# EAGLE design vswr (EAGLE 7.3.0)
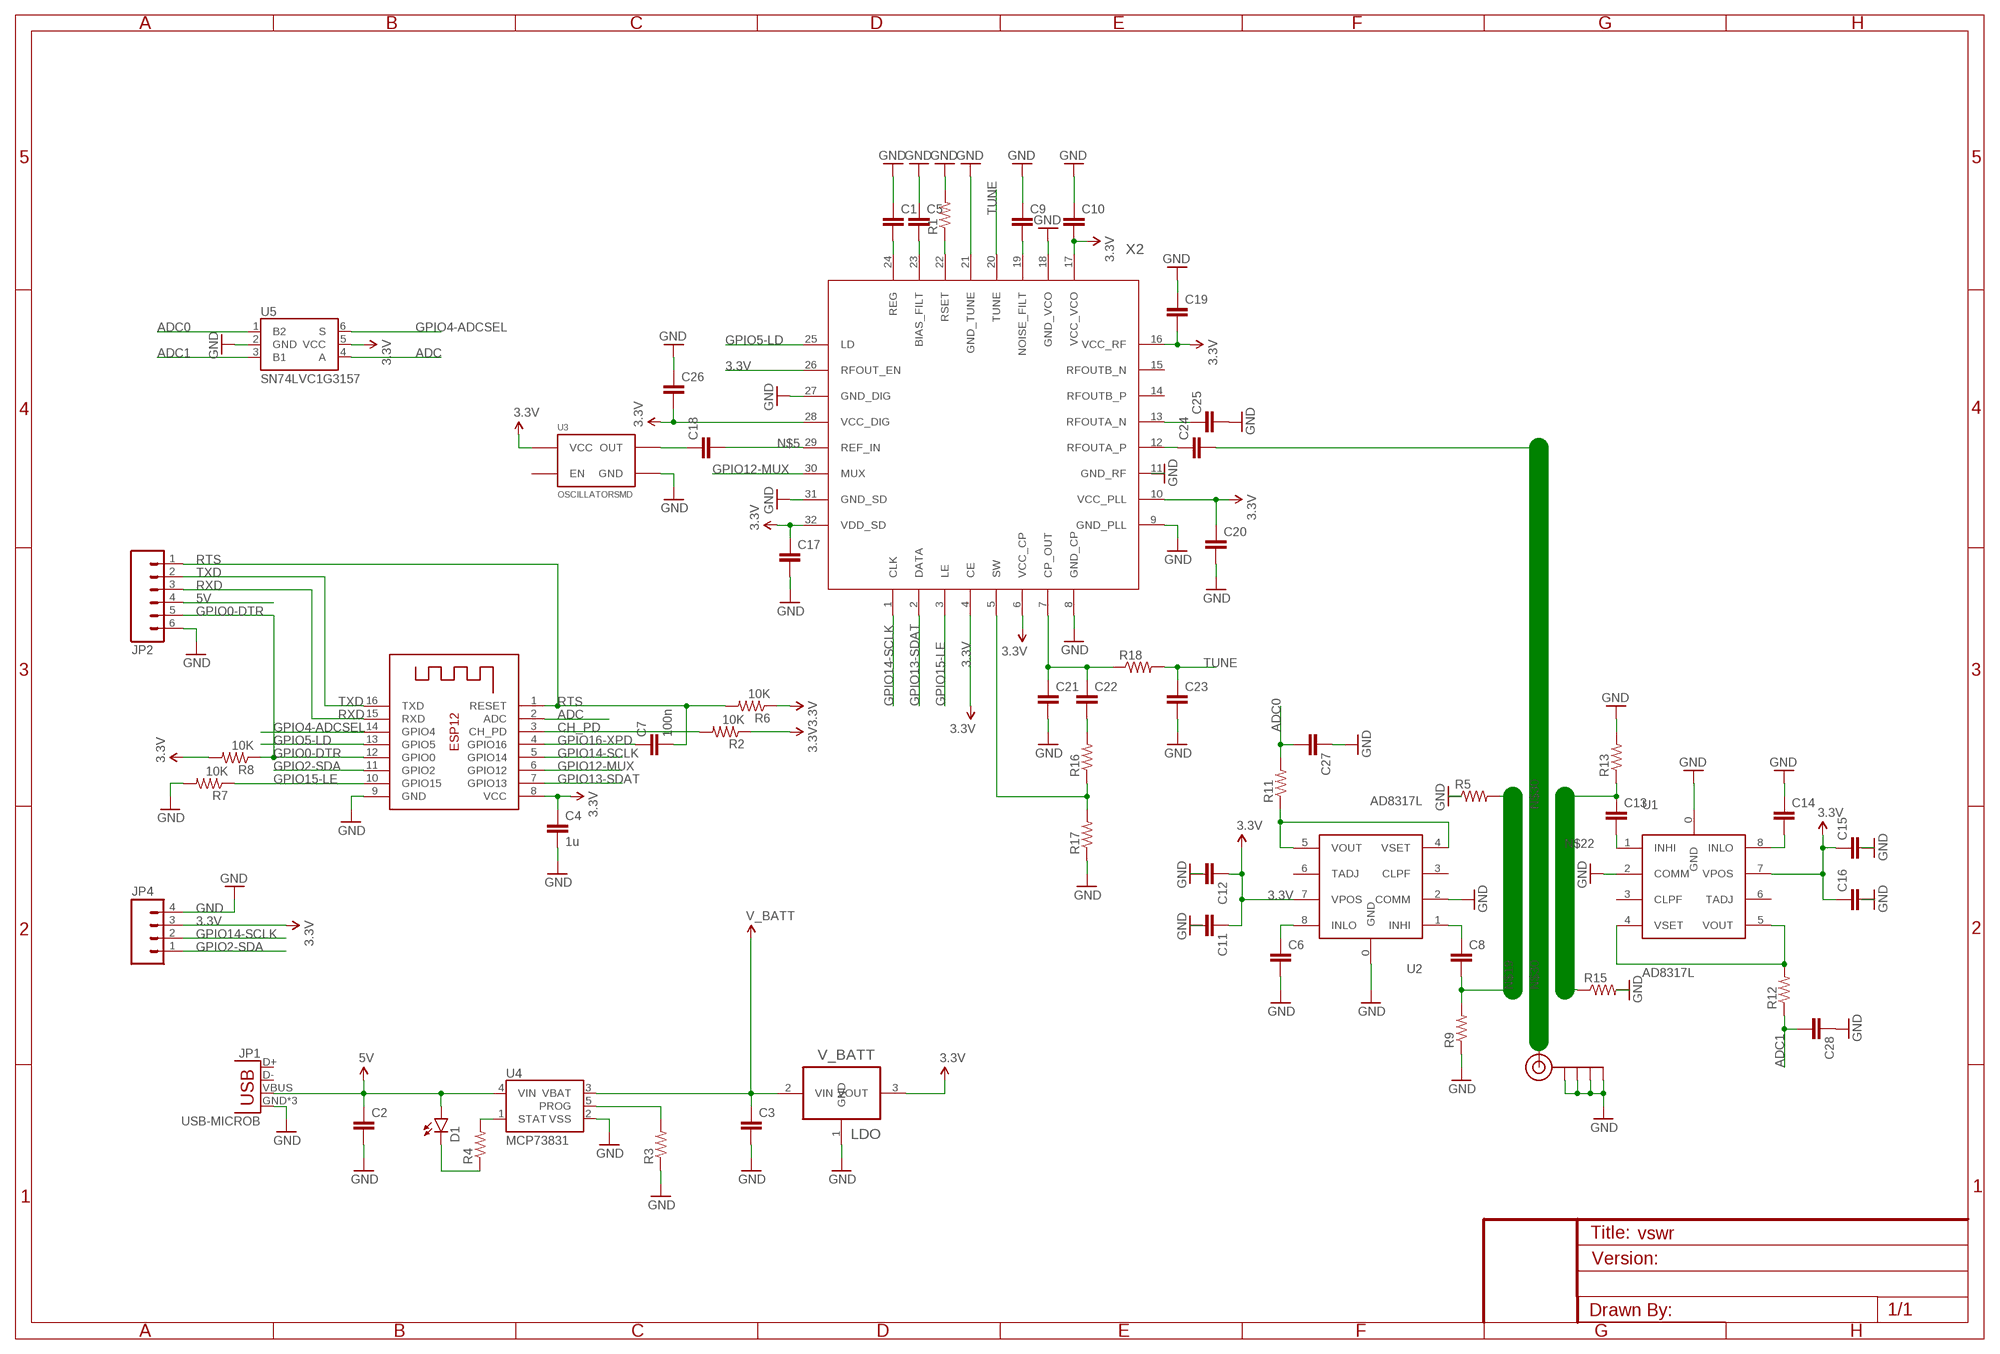
[diagram p0: schematic, sheet 1]

## Parts
C1  CAP0402  [0402]
C2  CAP0603  [0603]
C3  CAP0603  [0603]
C4  1u  CAP0603  [0603]
C5  CAP0402  [0402]
C6  CAP0402  [0402]
C7  100n  CAP0603  [0603]
C8  CAP0402  [0402]
C9  CAP0402  [0402]
C10  CAP0402  [0402]
C11  CAP0402  [0402]
C12  CAP0603  [0603]
C13  CAP0402  [0402]
C14  CAP0402  [0402]
C15  CAP0402  [0402]
C16  CAP0603  [0603]
C17  CAP0402  [0402]
C18  CAP0402  [0402]
C19  CAP0402  [0402]
C20  CAP0402  [0402]
C21  CAP0603  [0603]
C22  CAP0603  [0603]
C23  CAP0603  [0603]
C24  CAP0402  [0402]
C25  CAP0402  [0402]
C26  CAP0402  [0402]
C27  CAP0603  [0603]
C28  CAP0603  [0603]
D1  LED0603  [LED-0603]
J$1  SMA_EDGE  [SMA-EDGE]
JP1  USB-MICROB  [USB-MICROB]
JP2  M061X06-SMD_EDGE_FEMALE  [1X06-SMD_EDGE]
JP4  M04PTH  [1X04]
R1  RESISTOR0402  [0402]
R2  10K  RESISTOR0603  [0603]
R3  RESISTOR0603  [0603]
R4  RESISTOR0603  [0603]
R5  RESISTOR0402  [0402]
R6  10K  RESISTOR0603  [0603]
R7  10K  RESISTOR0603  [0603]
R8  10K  RESISTOR0603  [0603]
R9  RESISTOR0402  [0402]
R11  RESISTOR0603  [0603]
R12  RESISTOR0603  [0603]
R13  RESISTOR0402  [0402]
R15  RESISTOR0402  [0402]
R16  RESISTOR0402  [0402]
R17  RESISTOR0402  [0402]
R18  RESISTOR0402  [0402]
U1  AD8317L  [DFN-8-EXTRA]
U2  AD8317L  [DFN-8-EXTRA]
U3  OSCILLATORSMD  [CRYSTAL-SMD-7X5]
U4  MCP73831  [SOT23-5]
U5  SN74LVC1G3157  [SOT23-6]
V_BATT  LDO  MCP1700T-3302E/TTSOT89MCP1700-3N  [SOT89R]
X1  ESP-12  [ESP-12]
X2  MAX2870TQFN-32-EXTRA  [TQFN-32-EXTRA]

## Nets
3.3V: C4.1 C10.2 C11.1 C12.1 C15.1 C16.1 C17.1 C19.2 C20.1 C26.2 JP4.3 R2.1 R6.1 R8.2 U1.7(VPOS) U2.7(VPOS) U3.P$4(VCC) U5.5(VCC) V_BATT.3(VOUT) X1.8(VCC) X2.4(CE) X2.6(VCC_CP) X2.10(VCC_PLL) X2.16(VCC_RF) X2.17(VCC_VCO) X2.26(RFOUT_EN) X2.28(VCC_DIG) X2.32(VDD_SD)
5V: C2.1 D1.A JP1.VBUS JP2.4 U4.4(VIN)
ADC: U5.4(A) X1.2(ADC)
ADC0: C27.2 R11.2 U5.1(B2)
ADC1: C28.2 R12.1 U5.3(B1)
CH_PD: R2.2 X1.3(CH_PD)
GND [POWER]: C1.1 C2.2 C3.2 C4.2 C5.1 C6.2 C9.1 C10.1 C11.2 C12.2 C14.1 C15.2 C16.2 C17.2 C19.1 C20.2 C21.2 C23.2 C25.2 C26.1 C27.1 C28.1 J$1.GND@0(GND) J$1.GND@1(GND) J$1.GND@2(GND) J$1.GND@3(GND) JP1.GND JP1.MT1(GND) JP1.MT2(GND) JP2.6 JP4.4 R1.2 R3.1 R5.1 R7.2 R9.1 R13.2 R15.2 R17.1 U1.0(GND) U1.2(COMM) U2.0(GND) U2.2(COMM) U3.P$2(GND) U4.2(VSS) U5.2(GND) V_BATT.1(GND) X1.9(GND) X2.8(GND_CP) X2.9(GND_PLL) X2.11(GND_RF) X2.18(GND_VCO) X2.21(GND_TUNE) X2.27(GND_DIG) X2.31(GND_SD)
GPIO0-DTR: JP2.5 R8.1 X1.12(GPIO0)
GPIO2-SDA: JP4.1 X1.11(GPIO2)
GPIO4-ADCSEL: U5.6(S) X1.14(GPIO4)
GPIO5-LD: X1.13(GPIO5) X2.25(LD)
GPIO12-MUX: X1.6(GPIO12) X2.30(MUX)
GPIO13-SDAT: X1.7(GPIO13) X2.2(DATA)
GPIO14-SCLK: JP4.2 X1.5(GPIO14) X2.1(CLK)
GPIO15-LE: R7.1 X1.10(GPIO15) X2.3(LE)
GPIO16-XPD: C7.1 X1.4(GPIO16)
N$1: C1.2 X2.24(REG)
N$2: C5.2 X2.23(BIAS_FILT)
N$4: C9.2 X2.19(NOISE_FILT)
N$5: C18.2 X2.29(REF_IN)
N$8: D1.C R4.1
N$10: C13.2 U1.1(INHI)
N$11: R1.1 X2.22(RSET)
N$15: C6.1 U2.8(INLO)
N$16: C25.1 X2.13(RFOUTA_N)
N$18: C8.1 U2.1(INHI)
N$19: C8.2 R5.2 R9.2
N$20: R11.1 U2.4(VSET) U2.5(VOUT)
N$21: C18.1 U3.P$3(OUT)
N$22: C13.1 R13.1 R15.1
N$23: C21.1 C22.1 R18.1 X2.7(CP_OUT)
N$24: C24.1 X2.12(RFOUTA_P)
N$25: C14.2 U1.8(INLO)
N$26: C22.2 R16.2
N$27: R12.2 U1.4(VSET) U1.5(VOUT)
N$28: R16.1 R17.2 X2.5(SW)
N$30: C24.2 J$1.SIG(SIGNAL)
PROG: R3.2 U4.5(PROG)
RTS: C7.2 JP2.1 R6.2 X1.1(RESET)
RXD: JP2.3 X1.15(RXD)
STAT: R4.2 U4.1(STAT)
TUNE: C23.1 R18.2 X2.20(TUNE)
TXD: JP2.2 X1.16(TXD)
V_BATT [POWER]: C3.1 U4.3(VBAT) V_BATT.2(VIN)
Unconnected: JP1.D+ JP1.D- U1.3(CLPF) U1.6(TADJ) U2.3(CLPF) U2.6(TADJ) U3.P$1(EN) X2.14(RFOUTB_P) X2.15(RFOUTB_N)

## Library data of the parts
C1-C3 C5 C6 C8-C28 = drom:CAP: Capacitor
C4 C7 = naut:CAP: Capacitor
D1 = drom:LED: LEDs Standard schematic elements and footprints for 5mm, 3mm, 1206, and 0603 sized LEDs. 5mm - Spark Fun Electronics SKU : COM-00529 (and others)
J$1 = drom:SMA_EDGE: SMA Antenna Connector End launch SMA connector. The paste layer has been removed so that the connector can be hand soldered onto the board after reflow.
JP1 = drom:USB: USB Connectors; PROD_ID: CONN-09505
JP2 = drom:M06: Header 6 Standard 6-pin 0.1" header.
JP4 = drom:M04: Header 4 Standard 4-pin 0.1" header. Use with straight break away headers (SKU : PRT-00116), right angle break away headers (PRT-00553), swiss pins (PRT-00743), machine pins (PRT-00117), and female headers (PRT-00115). Molex polarized connector foot print use with SKU : PRT-08231 with associated crimp pins and housings. 1MM SMD Version SKU: PRT-10208
R1 R2 R5-R9 R11-R13 R15-R18 = drom:RESISTOR: Resistor
R3 R4 = naut:RESISTOR: Resistor
U1 U2 = drom:AD8317: Log Detector/Controller
U3 = drom:OSCILLATOR: Generic 7x5 oscillator
U4 = SparkFun-PowerIC:MCP73831: Miniature single cell, fully integrated Li-Ion, Li-polymer charge management controller http://ww1.microchip.com/downloads/en/DeviceDoc/21984a.pdf
U5 = drom:SN74LVC1G3157: Miniature single cell, fully integrated Li-Ion, Li-polymer charge management controller http://ww1.microchip.com/downloads/en/DeviceDoc/21984a.pdf
V_BATT = naut:MCP1700T-3302E/TT: Low Quiescent Current LDO
X1 = drom:ESP-12
X2 = drom:MAX2870

## Net classes
0 default: width 0.152 mm, drill 0.33 mm, clearance 0.152 mm
1 POWER: width 0.152 mm, drill 0.33 mm, clearance 0.152 mm

## Board
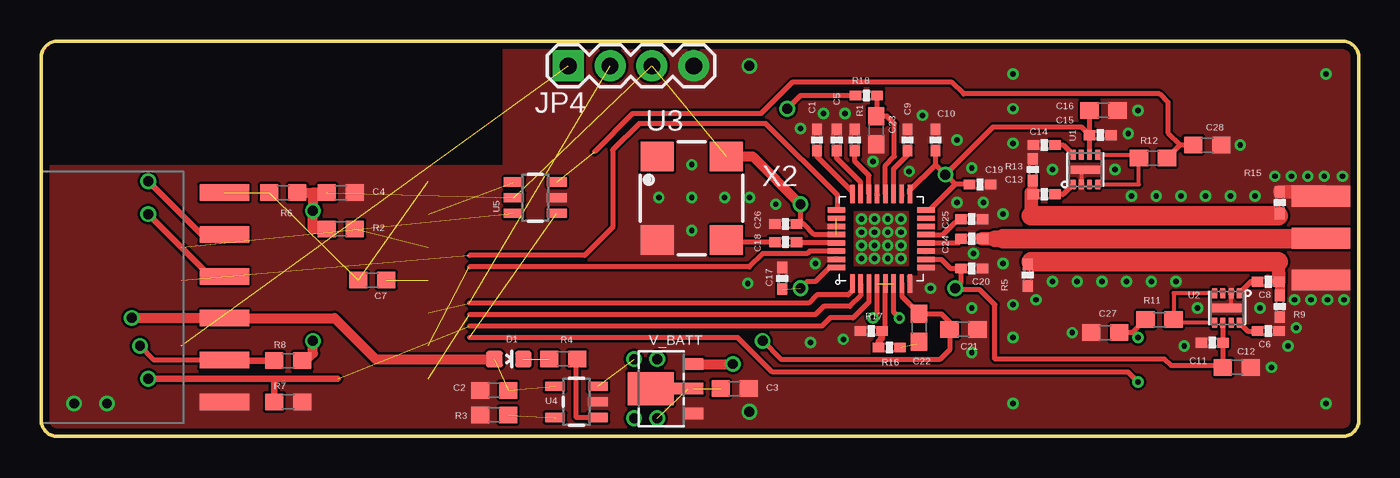
[diagram p1: board, top side]
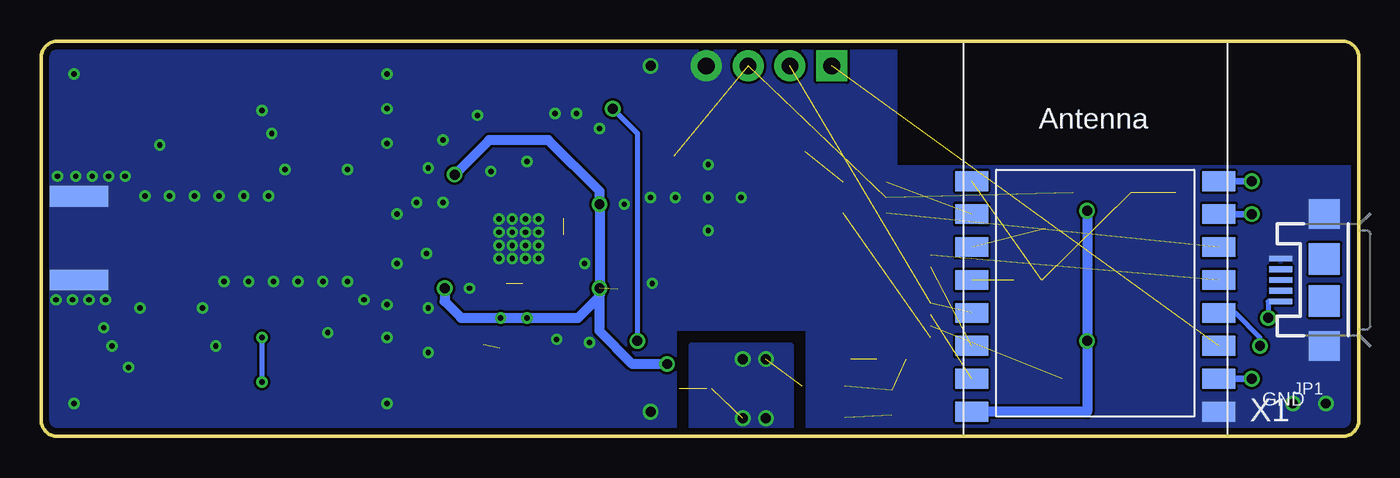
[diagram p2: board, bottom side, seen from below]

Size 80 x 24 mm. Coordinates in mm from the lower left corner, seen from the top.
Outline: 1,0 79,0 arc90 80,1 80,23 arc90 79,24 1,24 arc90 0,23 0,1 arc90 1,0
Copper layers (1*16): Top 0.0356mm / dielectric 0.52mm / Bottom 0.0356mm
Design rules "LaenPCBOrder *": minimum track width 6mil, minimum drill 13mil, track to track 6mil, track to pad 6mil, pad to pad 6mil, via to via 6mil, smd to smd 6mil, copper to edge 15mil, drill to drill 6mil, minimum pad ring 7mil, minimum via ring 7mil, stop-mask expansion 3mil, vias tented up to drill 24mil, thermal gap 0mil
tRestrict: area 48.8,13.7 to 53.2,14.2; area 48.8,9.8 to 49.3,14.2; area 48.8,9.8 to 53.2,10.3; area 52.7,9.8 to 53.2,14.2; area 0,16.5 to 28,24
bRestrict: area 0,16.5 to 28,24

### Footprints (pad centres in the part's own frame; a part is rotated, then mirrored left to right if it is on the bottom)
0402 = smd 0.7 x 0.6: 1 -0.65,0; 2 0.65,0
0603 = smd 1.1 x 1: 1 -0.85,0; 2 0.85,0
LED-0603 = smd 1 x 1: A 0,-0.877; C 0,0.877
SMA-EDGE = smd 1.27 x 3.556: GND@0 0,0; GND@1 5.08,0; SIG 2.54,0 | smd 1.27 x 3.556 bottom: GND@2 0,0; GND@3 5.08,0
USB-MICROB = smd 0.35 x 1.4: D+ 0,2.65; D- -0.65,2.65; GND 1.3,2.65; ID 0.65,2.65; VBUS -1.3,2.65 | smd 1.8 x 1.9: MT1 -4,0; MT2 4,0 | smd 1.9 x 1.9: P$1 -1.27,0; P$2 1.27,0
1X06-SMD_EDGE = smd 1 x 3: 1 0,-0.08; 2 2.54,-0.08; 3 5.08,-0.08; 4 7.62,-0.08; 5 10.16,-0.08; 6 12.7,-0.08
1X04 = drill 1.016 pad 1.88 square: 1 0,0 | drill 1.016 pad 1.88: 2 2.54,0; 3 5.08,0; 4 7.62,0
DFN-8-EXTRA = smd 0.5 x 1.8: 0 0,0 | smd 0.6 x 0.3: 1 -0.9,0.75; 2 -0.9,0.25; 3 -0.9,-0.25; 4 -0.9,-0.75; 5 0.9,-0.75; 6 0.9,0.25; 7 0.9,-0.25; 8 0.9,0.75
CRYSTAL-SMD-7X5 = smd 1.8 x 2: P$1 0,0; P$2 5.08,0; P$3 5.08,4.2; P$4 0,4.2
SOT23-5 = smd 0.55 x 1.2: 1 -0.95,-1.3; 2 0,-1.3; 3 0.95,-1.3; 4 0.95,1.3; 5 -0.95,1.3
SOT23-6 = smd 0.55 x 1.2: 1 -0.95,-1.3; 2 0,-1.3; 3 0.95,-1.3; 4 0.95,1.3; 5 0,1.3; 6 -0.95,1.3
SOT89R = smd 0.7 x 1.1: 1 -1.5,-1.75; 3 1.5,-1.75 | smd 0.7 x 1.8: 2 0,-1.4 | smd 2 x 2.8: 4 0,0.9
ESP-12 = smd 2 x 1.2: 1 -7.5,4.5; 2 -7.5,2.5; 3 -7.5,0.5; 4 -7.5,-1.5; 5 -7.5,-3.5; 6 -7.5,-5.5; 7 -7.5,-7.5; 8 -7.5,-9.5; 9 7.5,-9.5; 10 7.5,-7.5; 11 7.5,-5.5; 12 7.5,-3.5; 13 7.5,-1.5; 14 7.5,0.5; 15 7.5,2.5; 16 7.5,4.5
TQFN-32-EXTRA = smd 1.1 x 0.3: 1 -2.715,1.75; 2 -2.715,1.25; 3 -2.715,0.75; 4 -2.715,0.25; 5 -2.715,-0.25; 6 -2.715,-0.75; 7 -2.715,-1.25; 8 -2.715,-1.75; 17 2.715,-1.75; 18 2.715,-1.25; 19 2.715,-0.75; 20 2.715,-0.25; 21 2.715,0.25; 22 2.715,0.75; 23 2.715,1.25; 24 2.715,1.75 | smd 0.3 x 1.1: 9 -1.75,-2.715; 10 -1.25,-2.715; 11 -0.75,-2.715; 12 -0.25,-2.715; 13 0.25,-2.715; 14 0.75,-2.715; 15 1.25,-2.715; 16 1.75,-2.715; 25 1.75,2.715; 26 1.25,2.715; 27 0.75,2.715; 28 0.25,2.715; 29 -0.25,2.715; 30 -0.75,2.715; 31 -1.25,2.715; 32 -1.75,2.715

### Placement (x,y rotation side)
C1  47.1,18 270 top
C2  27.5,2.8 180 top
C3  42.1,2.9 0 top
C4  18.2,14.8 0 top
C5  48.3,18 270 top
C6  74.5,6.4 0 top
C7  20.1,9.5 180 top
C8  74.5,9.4 0 top
C9  52.6,18 270 top
C10  54.3,18 270 top
C11  71.1,5.7 180 top
C12  72.6,4.2 0 top
C13  60.9,14.7 0 top
C14  60.9,17.7 0 top
C15  64.3,18.3 0 top
C16  64.5,19.8 0 top
C17  45,9.6 90 top
C18  45.2,11.8 0 top
C19  57,15.3 180 top
C20  56.5,10.2 0 top
C21  56,6.5 0 top
C22  53.3,6.6 270 top
C23  50.7,18.6 270 top
C24  56.5,12 0 top
C25  56.5,13.2 0 top
C26  45.2,12.9 0 top
C27  64.6,6.3 0 top
C28  70.8,17.7 180 top
D1  28.4,4.7 270 top
J$1  77.7,9.5 90 top
JP1  2.1,9.5 90 bottom
JP2  11.2,14.8 270 top
JP4  32,22.5 0 top
R1  49.4,18 90 top
R2  18.2,12.6 0 top
R3  27.5,1.3 0 top
R4  31.7,4.7 0 top
R5  59.9,9.8 90 top
R6  14.7,14.8 180 top
R7  15,2.1 0 top
R8  15,4.6 0 top
R9  75.2,7.9 90 top
R11  67.9,7.1 180 top
R12  67.5,16.9 180 top
R13  60.2,16.2 90 top
R15  75.2,14.2 90 top
R16  51.5,5.4 0 top
R17  50.4,6.4 0 top
R18  50.1,20.7 0 top
U1  63.4,16.2 90 top
U2  72,7.8 270 top
U3  37.4,17 270 top
U4  32.5,2.1 90 top
U5  30,14.5 90 top
V_BATT  37.9,2.9 90 top
X1  16,11 0 bottom
X2  51,12 90 top

### Tracks (layer width: path | path; a pad name or v marks a point on that pad's centre or on a via)
3.3V  (via drill 0.33, 0.6)  (6 unrouted)
  Top 0.305: C12.1 C11.1 U2.7 71.75,4.3 68.6,4.3 68.2,4.7 57.9,4.7 57.9,8 57,8.9 55.6,8.9 v55.5,9 55.85,9.35 C20.1 55.2,10.2 54.65,10.75 X2.10 | U1.7 C15.1 | C15.1 C16.1 | v54.9,15.9 57.8,18.8 63.15,18.8 C15.1 | 52.75,15.05 X2.17 52.75,14.95 54.3,16.5 | 54.3,16.5 C10.2 | X2.16 53.95,13.75 55.5,15.3 | v54.9,15.9 54.3,16.5 | C19.2 55.5,15.3 | 55.5,15.3 v54.9,15.9 | X2.28 46.95,12.25 46.3,12.9 C26.2 46.1,13.1 v46.1,14.1 | v50.5,7.2 50.75,7.45 X2.4 | v52.1,7.2 51.75,7.55 X2.6 | X2.32 47.85,10.25 47,9.4 46.5,9.4 v46.1,9
  Top 0.406: 15.95,4.5 R8.2
  Top 0.61: U3.P$4 43.2,17 v46.1,14.1 | V_BATT.3 v42,4.4 | 15.95,4.5 16.5,5.05 v16.5,5.8 | R6.1 16.5,14.8 | C4.1 16.5,14.8 | 16.5,14.8 v16.5,13.7 16.5,12.6 R2.1
  Bottom 0.61: v46.1,9 46.1,8.5 47.4,7.2 v52.1,7.2 54.5,7.2 55.5,8.2 v55.5,9 | v46.1,9 v46.1,14.1 46.1,14.9 49.2,18 52.8,18 v54.9,15.9 | v42,4.4 44.1,4.4 46.1,6.4 v46.1,9 | v16.5,13.7 v16.5,5.8 16.5,1.5 X1.8
5V  (via drill 0.6)  (2 unrouted)
  Top 0.61: D1.A 20.3,4.7 17.82,7.18 JP2.4 5.52,7.18 v5.5,7.2
  Bottom 0.305: JP1.VBUS 5.5,8.2 v5.5,7.2
ADC  (1 unrouted)
ADC0  (via drill 0.33)  (1 unrouted)
  Top 0.305: v66.6,3.3 66,3.9 44.4,3.9 42.3,6 26,6 | R11.2 66.25,6.3 C27.2 66.3,6.3 v66.6,6
  Bottom 0.305: v66.6,6 v66.6,3.3
ADC1  (1 unrouted)
  Top 0.305: R12.1 69.15,17.7 | 69.15,17.7 C28.2 | 69.15,17.7 68.4,18.45 68.4,20.3 67.9,20.8 56,20.8 55.3,21.5 45.6,21.5 43.7,19.6 35.9,19.6 33.6,17.3
CH_PD  (1 unrouted)
GND  (via drill 0.33, 0.6)
  Top 0.254: U1.0 63.15,16.2 U1.2 | U2.0 72.25,7.8 U2.2
  Top 0.406: 77.9,14.85 J$1.GND@3
  Top 0.813: R15.2 77.9,14.85
  other vias: 49.8,13.2 50.6,13.2 51.4,13.2 52.2,13.2 49.8,12.4 50.6,12.4 51.4,12.4 52.2,12.4 52.2,11.6 51.4,11.6 50.6,11.6 49.8,11.6 49.8,10.8 50.6,10.8 51.4,10.8 52.2,10.8 70.2,7.8 74,7.8 65.9,9.4 64.4,9.4 62.9,9.4 59,8 61.4,9.4 68.9,9.4 67.4,9.4 73.7,14.6 72.2,14.6 70.7,14.6 69.2,14.6 67.7,14.6 66.2,14.6 65.2,16.2 61.4,16.2 79,15.8 77.9,15.8 76.9,15.8 75.9,15.8 74.9,15.8 79.1,8.3 78.1,8.3 77.1,8.3 76.1,8.3 50.5,16.7 52.7,16.1 43,14.5 48.8,19.6 47.5,19.6 54,9 44.6,14.1 42.9,9.3 48.7,5.9 47,10.5 76.2,6.6 75.7,5.5 74.7,4.2 62.6,6.3 72.8,17.7 66,18.4 66.6,19.8 59,17.8 69.4,5.5 56.5,7.8 56.5,5.1 56.5,16.3 55.6,14.2 57.2,14.2 55.6,18 53.5,19.5 46.1,18.7 46.7,5.7 56.6,11.1 58.4,10.5 58.4,13.5 78,22 78,2 37.5,14.5 41.5,14.5 39.5,14.5 39.5,12.5 39.5,16.5 59,22 60.4,8.3 59,19.9 59,6 59,2 2,2 4,2 43,1.5 43,22.5
  pour Bottom: 80,24 0,24 0,0 33.5,0 33.5,6.5 41.5,6.5 41.5,0 80,0
  pour Top: 0,24 80,24 80,0 0,0
GPIO0-DTR  (via drill 0.6)
  Top 0.305: JP2.5 6.86,4.64 v6,5.5
  Top 0.406: R8.1 11.16,4.6 JP2.5
  Bottom 0.305: X1.12 7.5,7.5 6,6 v6,5.5
GPIO2-SDA  (1 unrouted)
GPIO4-ADCSEL  (1 unrouted)
GPIO5-LD  (1 unrouted)
  Top 0.305: 26,11 33,11 34.7,12.7 34.7,17.4 36.3,19 44,19 48.35,14.65 48.35,13.75 X2.25
GPIO12-MUX  (1 unrouted)
  Top 0.305: X2.30 46.65,11.25 46.5,11.1 43.8,11.1 43,10.3 26,10.3
GPIO13-SDAT  (1 unrouted)
  Top 0.305: X2.2 49.75,8.55 49.1,7.9 47.5,7.9 47,7.4 26,7.4
GPIO14-SCLK  (2 unrouted)
  Top 0.305: X2.1 49.25,8.85 49,8.6 47.1,8.6 46.6,8.1 26,8.1
GPIO15-LE  (via drill 0.6)  (1 unrouted)
  Top 0.305: X2.3 50.25,8.15 49.3,7.2 47.9,7.2 47.4,6.7 26,6.7
  Top 0.406: 14.15,3.5 v6.5,3.5 | 14.15,3.5 R7.1 | 14.15,3.5 18,3.5
  Bottom 0.406: v6.5,3.5 X1.10
GPIO16-XPD  (1 unrouted)
N$1
  Top 0.305: X2.24 49.25,14.85 47.1,17 C1.2
N$2
  Top 0.305: X2.23 49.75,15.45 48.3,16.9 C5.2
N$4
  Top 0.305: X2.19 51.75,16.25 52.6,17.1 C9.2
N$5
  Top 0.305: X2.29 46.2,11.75 C18.2
N$8  (1 unrouted)
N$10
  Top 0.305: U1.1 62.05,14.7 C13.2
N$11
  Top 0.305: X2.22 50.25,15.85 49.4,16.7 R1.1
N$15
  Top 0.305: U2.8 73.25,6.4 C6.1
N$16
  Top 0.305: X2.13 54.75,12.25 55.5,13 C25.1
N$18
  Top 0.305: C8.1 73.45,9.4 U2.1
N$19
  Top 0.406: R5.2 60.1,10.6 | C8.2 75.2,9.2
  Top 0.61: 75.2,9.2 R9.2
  Top 0.813: 75.1,10.6 C8.2
  Top 1.18: 60.1,10.6 75.1,10.6
N$20
  Top 0.254: U2.4 68.75,8.7 R11.1 68.75,6.9 U2.5
N$21
  Top 0.305: C18.1 41.82,11.8 U3.P$3
N$22
  Top 0.305: 60.2,14.75 C13.1 60.2,14.7 60.1,14.8 | R15.1 75.2,13.5 75.1,13.4
  Top 0.61: 60.2,14.75 R13.1
  Top 0.813: 60.1,14.8 60.1,13.4
  Top 1.18: 60.1,13.4 75.1,13.4
N$23  (via drill 0.6)
  Top 0.305: X2.7 52.25,8.5 C22.1 54.65,7.45 55.15,6.95 C21.1 55.15,5.25 54.6,4.7 44.9,4.7 v43.8,5.8 | R18.1 46.1,20.7 v45.3,19.9
  Bottom 0.305: v45.3,19.9 43.8,18.4 v43.8,5.8
N$24
  Top 0.305: X2.12 55.7,11.75 C24.1
N$25
  Top 0.305: C14.2 62.05,17.7 U1.8
N$26  (1 unrouted)
  Top 0.305: 53.15,5.6 C22.2
N$27
  Top 0.254: U1.4 66.65,15.3 R12.2 66.65,17.1 U1.5
N$28
  Top 0.305: R17.2 51.25,6.6 X2.5
  Top 0.406: R16.1 50.85,5.75 51.05,5.95 R17.2
N$30
  Top 0.406: 77.9,12 J$1.SIG
  Top 0.813: C24.2 57.9,12
  Top 1.016: 57.9,12 58.4,12
  Top 1.18: 58.4,12 77.9,12
PROG  (1 unrouted)
RTS  (3 unrouted)
RXD  (via drill 0.6)
  Top 0.406: JP2.3 10.28,9.72 v6.5,13.5
  Bottom 0.406: v6.5,13.5 X1.15
STAT
  Top 0.305: U4.1 32.5,1.15 32.5,4.4 R4.2
TUNE
  Top 0.305: X2.20 51.25,16.45 51.8,17 51.8,19 51.35,19.45 C23.1 50.75,19.5 R18.2
TXD  (via drill 0.6)
  Top 0.406: JP2.2 11.12,12.28 11.1,12.3 9.7,12.3 v6.5,15.5
  Bottom 0.406: v6.5,15.5 X1.16
V_BATT  (via drill 0.6)  (3 unrouted)
  Top 0.61: 39.4,2.9 V_BATT.2 39.6,2.9
  other vias: 36,4.7 36,1.1 37.4,4.7 37.4,1.1
  pour Bottom: 34.5,5.5 40.5,5.5 40.5,0.5 34.5,0.5

### Text on the board
bPlace: GND